# Altium project Microphone_ESP32_Board.PrjPcb
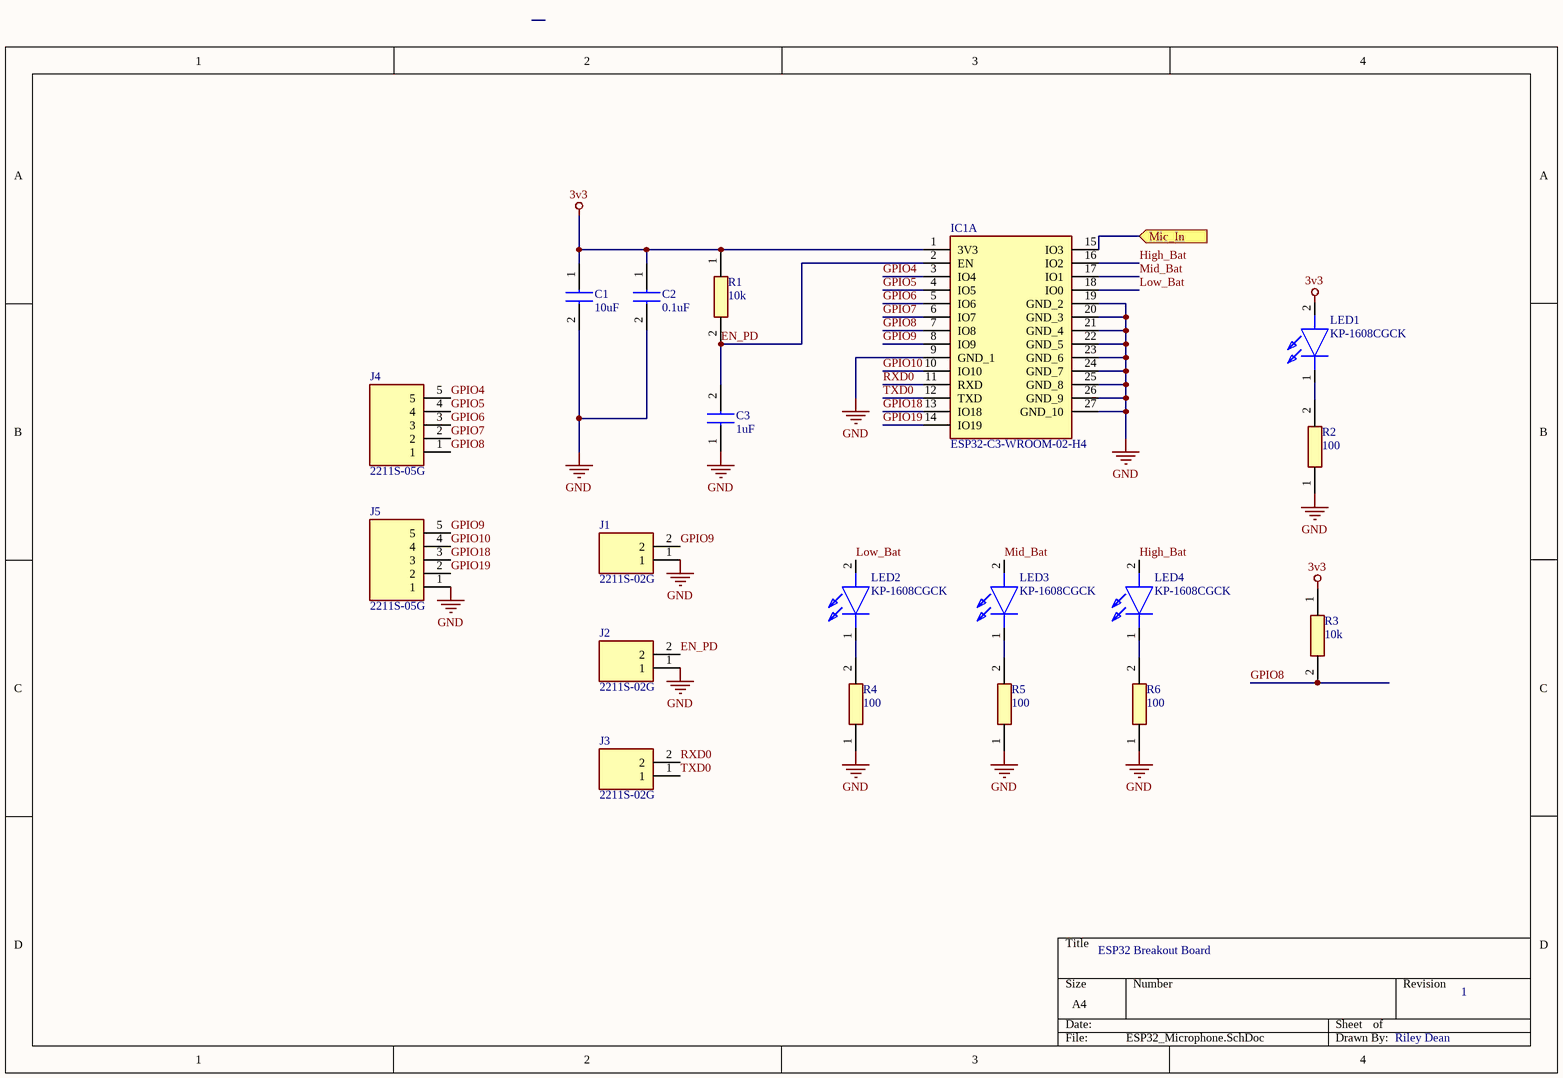
[diagram p0: ESP32_Microphone.SchDoc]
2 sheets, 19 parts. Net scope: flat (ports and power ports of the same name join across sheets).
Sheets:
  Top_Level.SchDoc
  ESP32_Microphone.SchDoc

## Sheet Top_Level.SchDoc
size A4; SheetNumber: 1; SheetTotal: 2

## Sheet ESP32_Microphone.SchDoc
size A4; SheetNumber: 2; SheetTotal: 3

### Parts
C1  10uF  [C0805]
C2  0.1uF  [CAPC1608X90N]
C3  1uF  [CAPC1608X90N]
IC1  ESP32-C3-WROOM-02-H4  [ESP32C3WROOM02H4]  (part A of 2)
J1  2211S-02G  [HDRV2W64P0X254_1X2_508X254X874P]
J2  2211S-02G  [HDRV2W64P0X254_1X2_508X254X874P]
J3  2211S-02G  [HDRV2W64P0X254_1X2_508X254X874P]
J4  2211S-05G  [HDRV5W90P0X254_1X5_1270X254X1174P]
J5  2211S-05G  [HDRV5W90P0X254_1X5_1270X254X1174P]
LED1  KP-1608CGCK  [LEDC1608X120N]
LED2  KP-1608CGCK  [LEDC1608X120N]
LED3  KP-1608CGCK  [LEDC1608X120N]
LED4  KP-1608CGCK  [LEDC1608X120N]
R1  10k  [RESC1608X55N]
R2  100  [RESC1608X55N]
R3  10k  [RESC1608X55N]
R4  100  [RESC1608X55N]
R5  100  [RESC1608X55N]
R6  100  [RESC1608X55N]

### Ports
Mic_In (in)

### Nets
3v3: C1.1 C2.1 IC1.1(3V3) LED1.2(A) R1.1 R3.1
GND: C1.2 C2.2 C3.1 IC1.9(GND_1) IC1.19(GND_2) IC1.20(GND_3) IC1.21(GND_4) IC1.22(GND_5) IC1.23(GND_6) IC1.24(GND_7) IC1.25(GND_8) IC1.26(GND_9) IC1.27(GND_10) J1.1 J2.1 J5.1 R2.1 R4.1 R5.1 R6.1
EN_PD: C3.2 IC1.2(EN) J2.2 R1.2
GPIO4: IC1.3(IO4) J4.5
GPIO5: IC1.4(IO5) J4.4
GPIO6: IC1.5(IO6) J4.3
GPIO7: IC1.6(IO7) J4.2
GPIO8: IC1.7(IO8) J4.1 R3.2
GPIO9: IC1.8(IO9) J1.2 J5.5
GPIO10: IC1.10(IO10) J5.4
GPIO18: IC1.13(IO18) J5.3
GPIO19: IC1.14(IO19) J5.2
High_Bat: IC1.16(IO2) LED4.2(A)
Low_Bat: IC1.18(IO0) LED2.2(A)
Mid_Bat: IC1.17(IO1) LED3.2(A)
RXD0: IC1.11(RXD) J3.2
TXD0: IC1.12(TXD) J3.1
NetIC1_15: IC1.15(IO3) ; port Mic_In
NetLED1_1: LED1.1(K) R2.2
NetLED2_1: LED2.1(K) R4.2
NetLED3_1: LED3.1(K) R5.2
NetLED4_1: LED4.1(K) R6.2

### Notes on the sheet
- ESP32 Breakout Board
- 1
- Riley Dean

### Library data of the parts
C1 = C0805C106K4PACTU: Capacitor; Manufacturer_Name: KEMET; Datasheet Link: https://content.kemet.com/datasheets/KEM_C1006_X5R_SMD.pdf; Height: 1.1mm; Manufacturer_Part_Number: C0805C106K4PACTU; Mouser Part Number: 80-C0805C106K4P; Mouser Price/Stock: https://www.mouser.co.uk/ProductDetail/KEMET/C0805C106K4PACTU?qs=LOQsJ2JwiRQzQlGR%2F0Z13g%3D%3D; Arrow Part Number: C0805C106K4PACTU; Arrow Price/Stock: https://www.arrow.com/en/products/c0805c106k4pactu/kemet-corporation
C2 = CC0603KRX7R7BB104: Capacitor; Manufacturer_Name: KEMET; Datasheet Link: https://ms.componentsearchengine.com/Datasheets/2/CC0603KRX7R7BB104.pdf; Height: 0.9mm; Manufacturer_Part_Number: CC0603KRX7R7BB104; Mouser Part Number: 603-CC603KRX7R7BB104; Mouser Price/Stock: https://www.mouser.co.uk/ProductDetail/YAGEO/CC0603KRX7R7BB104?qs=AgBp2OyFlx8KPmNTlFoWXA%3D%3D; Arrow Part Number: CC0603KRX7R7BB104; Arrow Price/Stock: https://www.arrow.com/en/products/cc0603krx7r7bb104/yageo?region=nac
C3 = C0603C105K4RACTU7042: Capacitor; Manufacturer_Name: KEMET; Datasheet Link: https://www.arrow.com/en/products/c0603c105k4ractu7042/kemet-corporation; Height: 0.9mm; Manufacturer_Part_Number: C0603C105K4RACTU7042; Arrow Part Number: C0603C105K4RACTU7042; Arrow Price/Stock: https://www.arrow.com/en/products/c0603c105k4ractu7042/kemet-corporation
IC1 = ESP32-C3-WROOM-02-H4: Integrated Circuit; Manufacturer_Name: Espressif Systems; Datasheet Link: https://www.mouser.in/datasheet/2/891/Espressif_Systems_04082021_ESP32_C3_WROOM_02-2295851.pdf; Height: 3.35mm; Manufacturer_Part_Number: ESP32-C3-WROOM-02-H4; Mouser Part Number: 356-ESP32C3WROOM02H4; Mouser Price/Stock: https://www.mouser.co.uk/ProductDetail/Espressif-Systems/ESP32-C3-WROOM-02-H4?qs=stqOd1AaK79%2FSA14oWtR%252Bw%3D%3D
J1-J3 = 2211S-02G: Connector; Manufacturer_Name: MULTICOMP; Datasheet Link: https://uk.farnell.com/multicomp/2211s-02g/header-1-row-vert-2way/dp/1593411; Height: 8.74mm; Manufacturer_Part_Number: 2211S-02G
J4 J5 = 2211S-05G: Connector; Manufacturer_Name: MULTICOMP; Datasheet Link: http://www.farnell.com/datasheets/1518407.pdf; Height: 11.74mm; Manufacturer_Part_Number: 2211S-05G
LED1-LED4 = KP-1608CGCK: LED; Manufacturer_Name: Kingbright; Datasheet Link: https://componentsearchengine.com/Datasheets/2/KP-1608CGCK.pdf; Height: 1.2mm; Manufacturer_Part_Number: KP-1608CGCK; Mouser Part Number: N/A; Mouser Price/Stock: https://www.mouser.co.uk/ProductDetail/Kingbright/KP-1608CGCK?qs=2JU0tDl2GZ3U0MYrqLedOQ%3D%3D; Arrow Part Number: KP-1608CGCK; Arrow Price/Stock: https://www.arrow.com/en/products/kp-1608cgck/kingbright?region=europe
R1 R3 = RC0603FR-0710KL: Resistor; Manufacturer_Name: KEMET; Datasheet Link: https://datasheet.datasheetarchive.com/originals/distributors/Datasheets_SAMA/902f9e387b938f871d31120f5fc1d65e.pdf; Height: 0.55mm; Manufacturer_Part_Number: RC0603FR-0710KL; Mouser Part Number: 603-RC0603FR-0710KL; Mouser Price/Stock: https://www.mouser.co.uk/ProductDetail/YAGEO/RC0603FR-0710KL?qs=grNVn54RoB%252B3GtjbJj3wJQ%3D%3D; Arrow Part Number: RC0603FR-0710KL; Arrow Price/Stock: https://www.arrow.com/en/products/rc0603fr-0710kl/yageo?region=nac
R2 R4-R6 = RC0603JR07470RL: Resistor; Manufacturer_Name: KEMET; Height: 0.55mm; Manufacturer_Part_Number: RC0603JR07470RL; Arrow Part Number: RC0603JR07470RL; Arrow Price/Stock: https://www.arrow.com/en/products/rc0603jr-07470rl/yageo